# EAGLE design potentiometer (EAGLE 9.6.2)
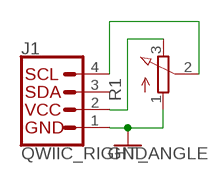
[diagram p0: schematic, sheet 1]

## Parts
J1  QWIIC_RIGHT_ANGLE  QWIIC_CONNECTORJS-1MM  [JST04_1MM_RA]
R1  3RP/1610N  [3RP/1610N]

## Nets
GND: J1.1 R1.1(A)
N$2: J1.2 R1.3(E)
N$3: J1.4 R1.2(S)
Unconnected: J1.3

## Library data of the parts
J1 = SparkFun-Connectors:QWIIC_CONNECTOR: SparkFun I2C Standard Qwiic Connector An SMD 1mm pitch JST connector makes it easy and quick (get it? Qwiic?) to connect I2C devices to each other. The Qwiic system <http://www.sparkfun.com/qwiic> enables fast and solderless connection between popular platforms and various sensors and actuators. We carry 200mm <https://www.sparkfun.com/products/14204>, 100mm <https://www.sparkfun.com/products/14205>, 50mm <https://www.sparkfun.com/products/14206>, and breadboard friendly <https://www.sparkfun.com/products/14207> Qwiic cables. We also offer 10 pcs strips <https://www.sparkfun.com/products/14323> the SMD connectors.; PROD_ID: CONN-13694
R1 = pot:3RP/1610N: 16mm Potentiometer one level Source: http://www.alphapotentiometers.net/html/16mm_pot_2.html

## Board
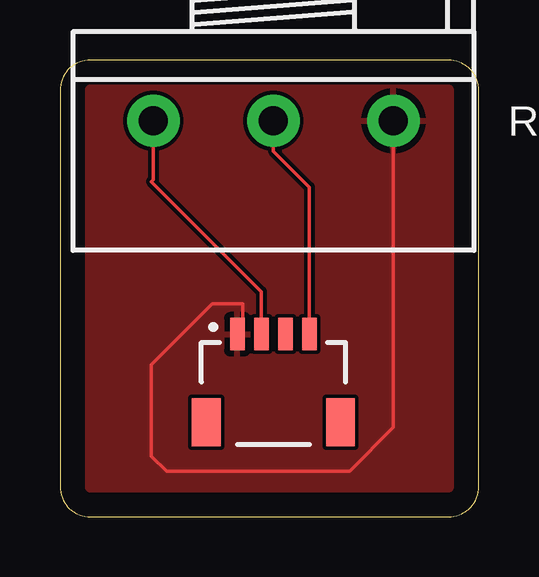
[diagram p1: board, top side]

Size 17.45 x 19.04 mm. Coordinates in mm from the lower left corner, seen from the top.
Outline: 0,17.77 0,1.27 arc90 1.27,0 16.18,0 arc90 17.45,1.27 17.45,17.77 arc90 16.18,19.04 1.27,19.04 arc90 0,17.77
Copper layers (1*16): Top 0.035mm / dielectric 1.5mm / Bottom 0.035mm
Design rules "default": minimum track width 6mil, minimum drill 0.35mm, track to track 6mil, track to pad 6mil, pad to pad 6mil, via to via 6mil, smd to smd 6mil, copper to edge 40mil, drill to drill 6mil, minimum pad ring 10mil, minimum via ring 8mil, stop-mask expansion 4mil, vias tented up to drill 0mil, thermal gap 10mil

### Footprints (pad centres in the part's own frame; a part is rotated, then mirrored left to right if it is on the bottom)
JST04_1MM_RA = smd 0.6 x 1.35: 1 -1.5,0; 2 -0.5,0; 3 0.5,0; 4 1.5,0 | smd 1.2 x 2: NC1 2.8,-3.675; NC2 -2.8,-3.675
3RP/1610N = drill 1.2 pad 2.184: 1 -5,0; 2 0,0; 3 5,0

### Placement (x,y rotation side)
J1  8.89,7.62 0 top
R1  8.89,16.51 180 top

### Tracks (layer width: path | path; a pad name or v marks a point on that pad's centre or on a via)
GND
  Top 0.152: R1.1 13.89,3.73 12.06,1.91 4.45,1.91 3.81,2.54 3.81,6.35 6.35,8.89 7.62,8.89 7.62,7.62
  pour Top: 0,1.27 0,17.78 arc-90 1.27,19.05 16.51,19.05 arc-90 17.78,17.78 17.78,1.27 arc-90 16.51,0 1.27,0 arc-90
N$2
  Top 0.152: R1.3 3.89,14.05 3.81,13.97 8.39,9.39 J1.2
N$3
  Top 0.152: R1.2 8.89,15.24 10.39,13.74 J1.4